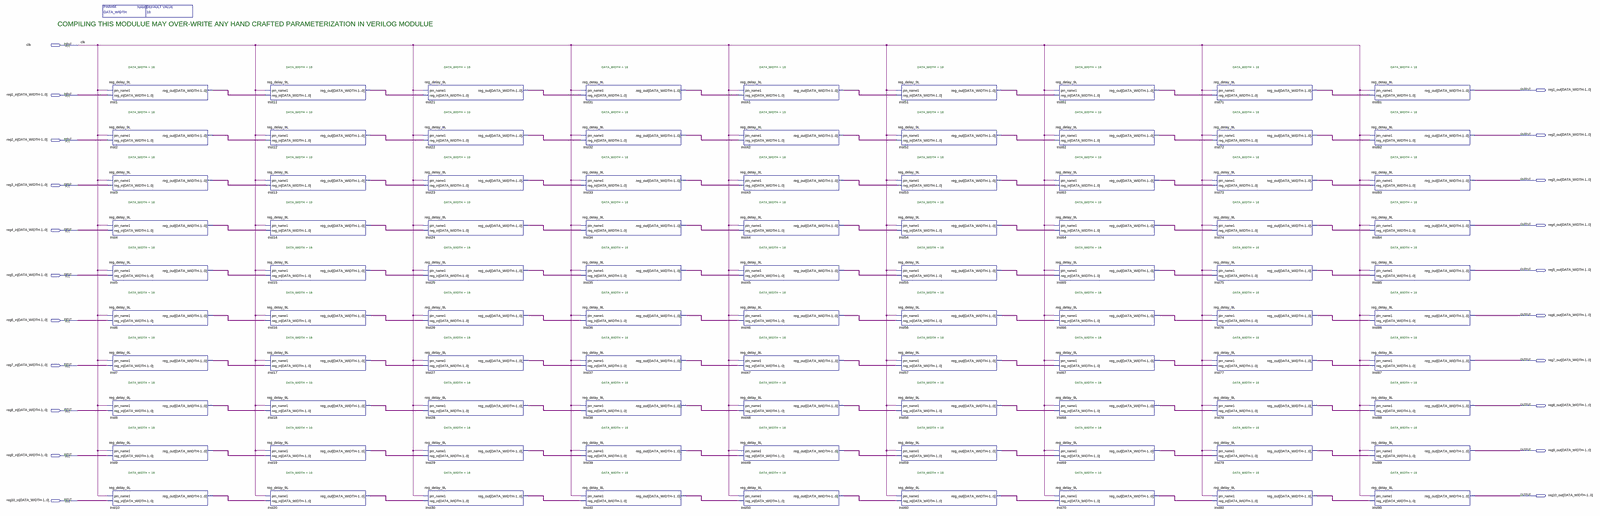
[diagram p0: schematic sheet, whole]
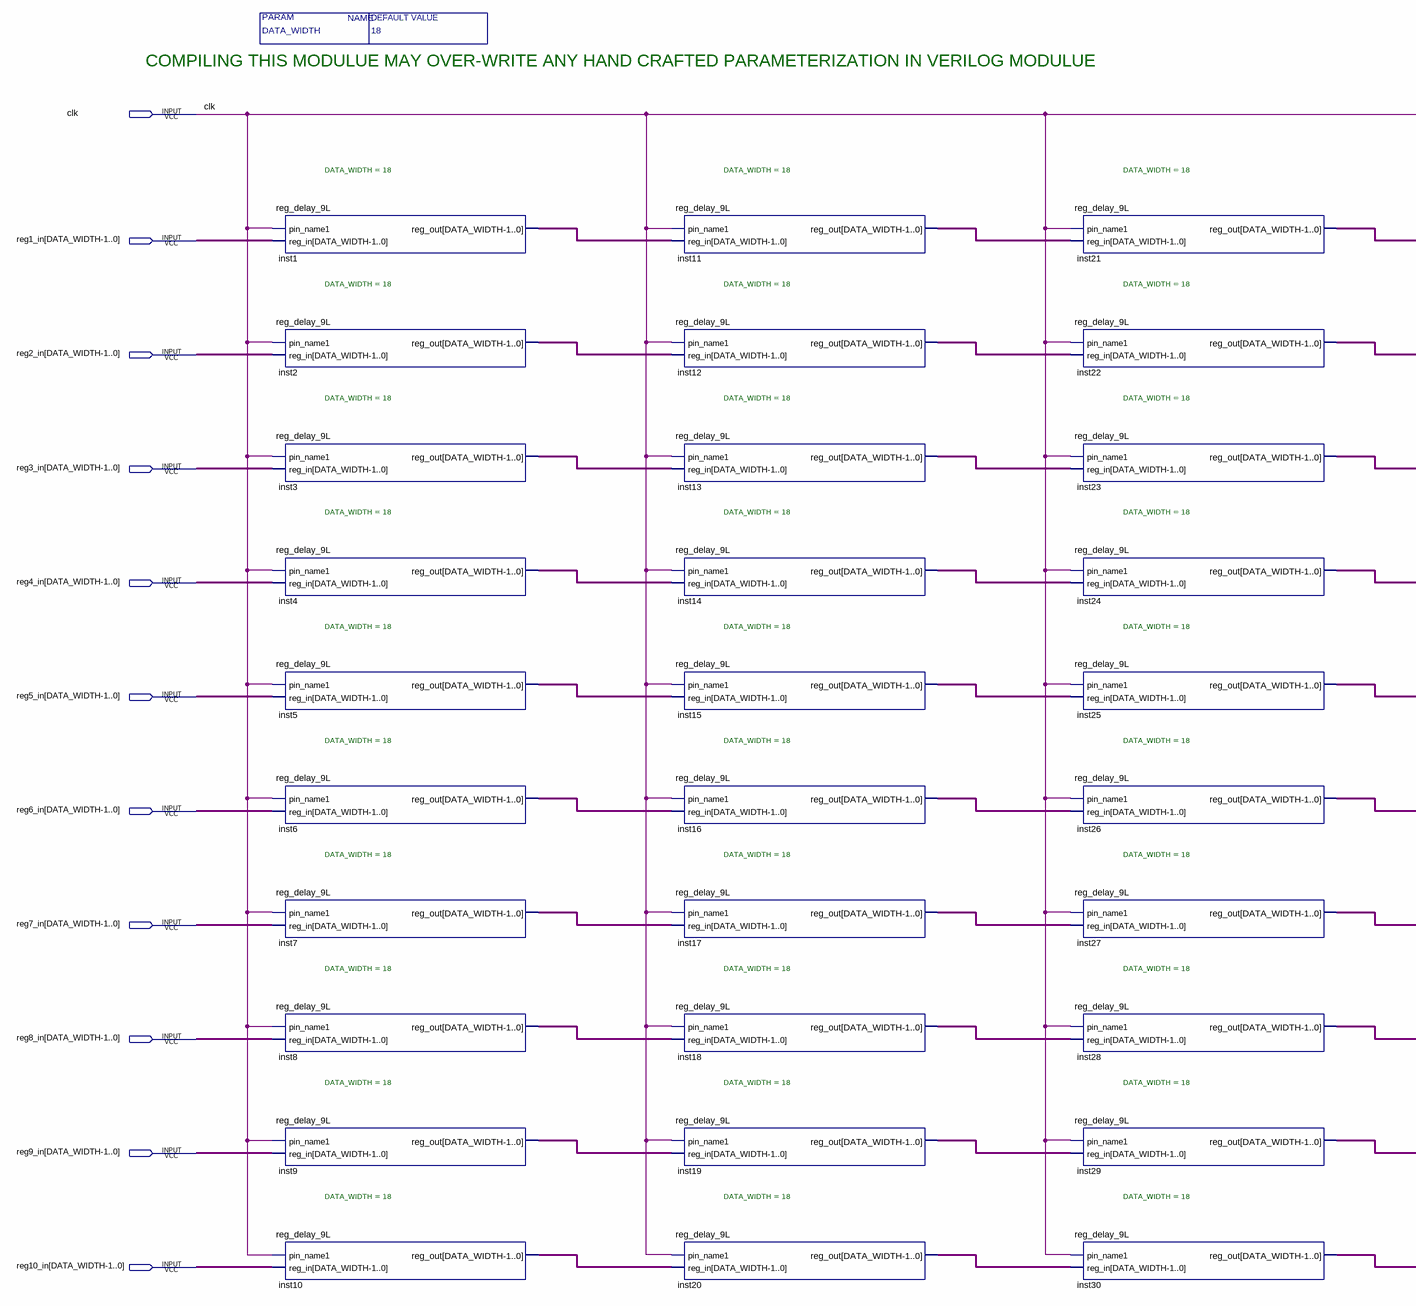
[diagram p1: schematic sheet, left part]
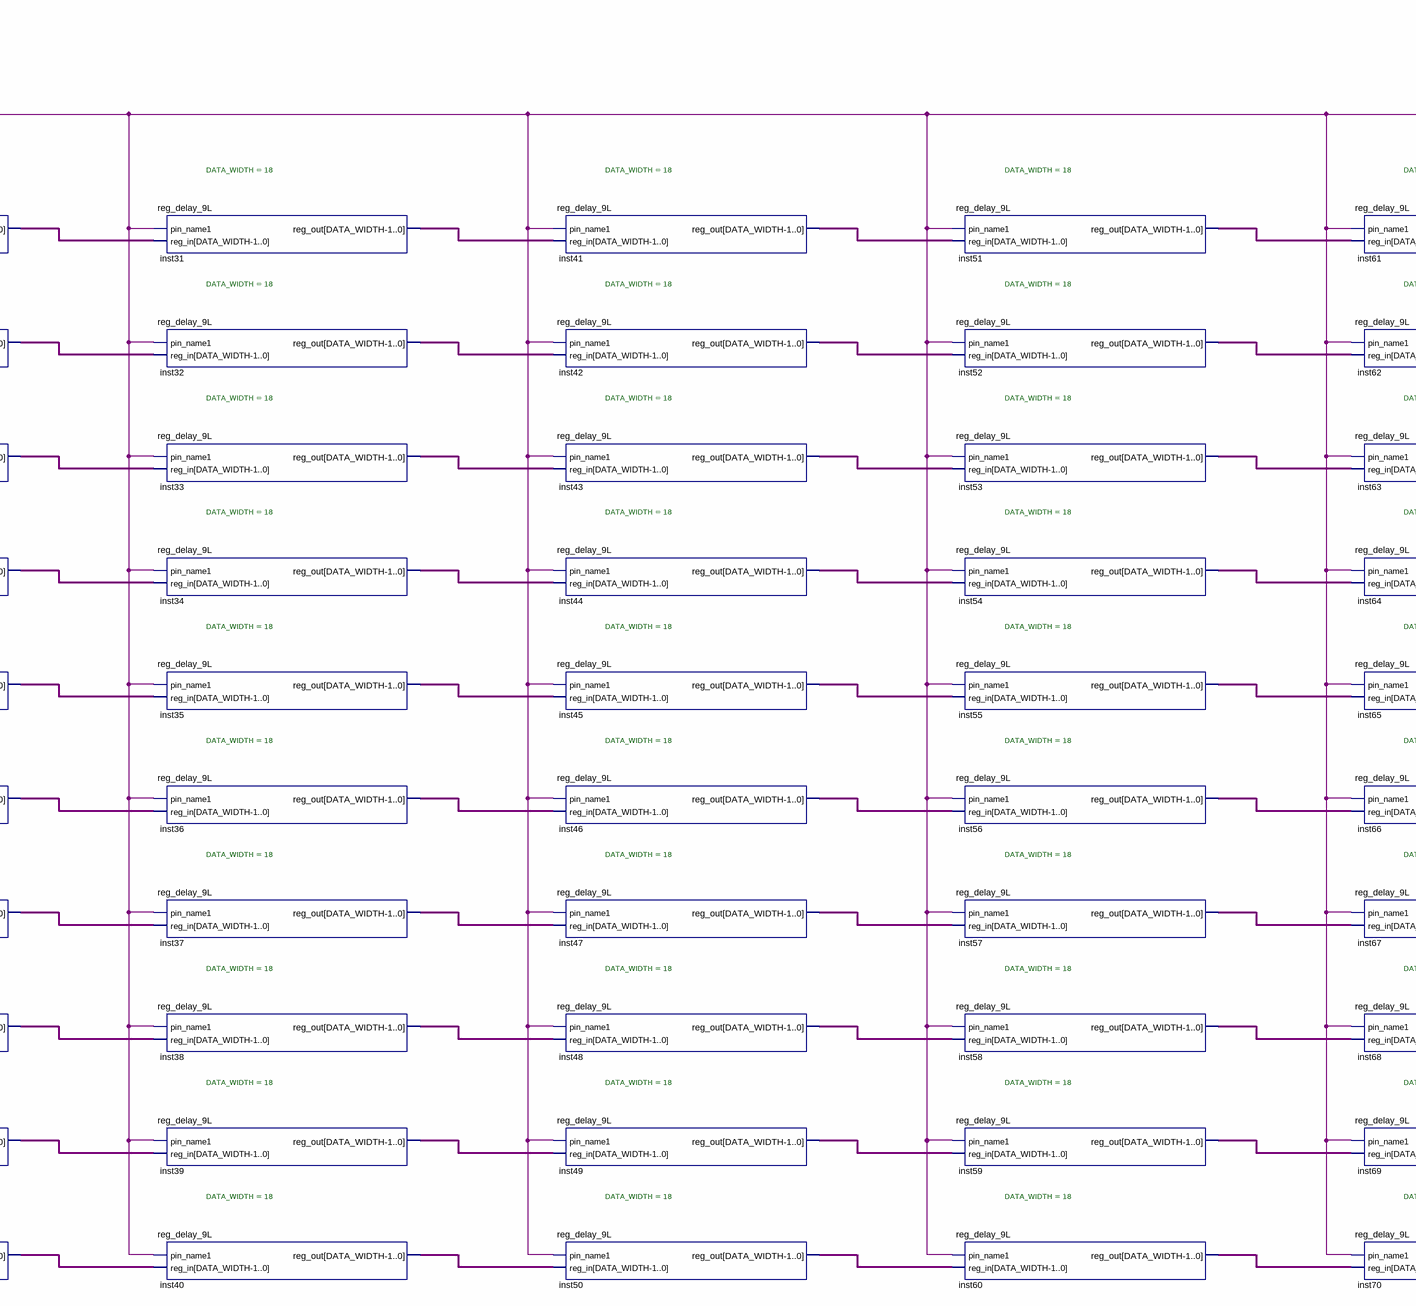
[diagram p2: schematic sheet, centre part]
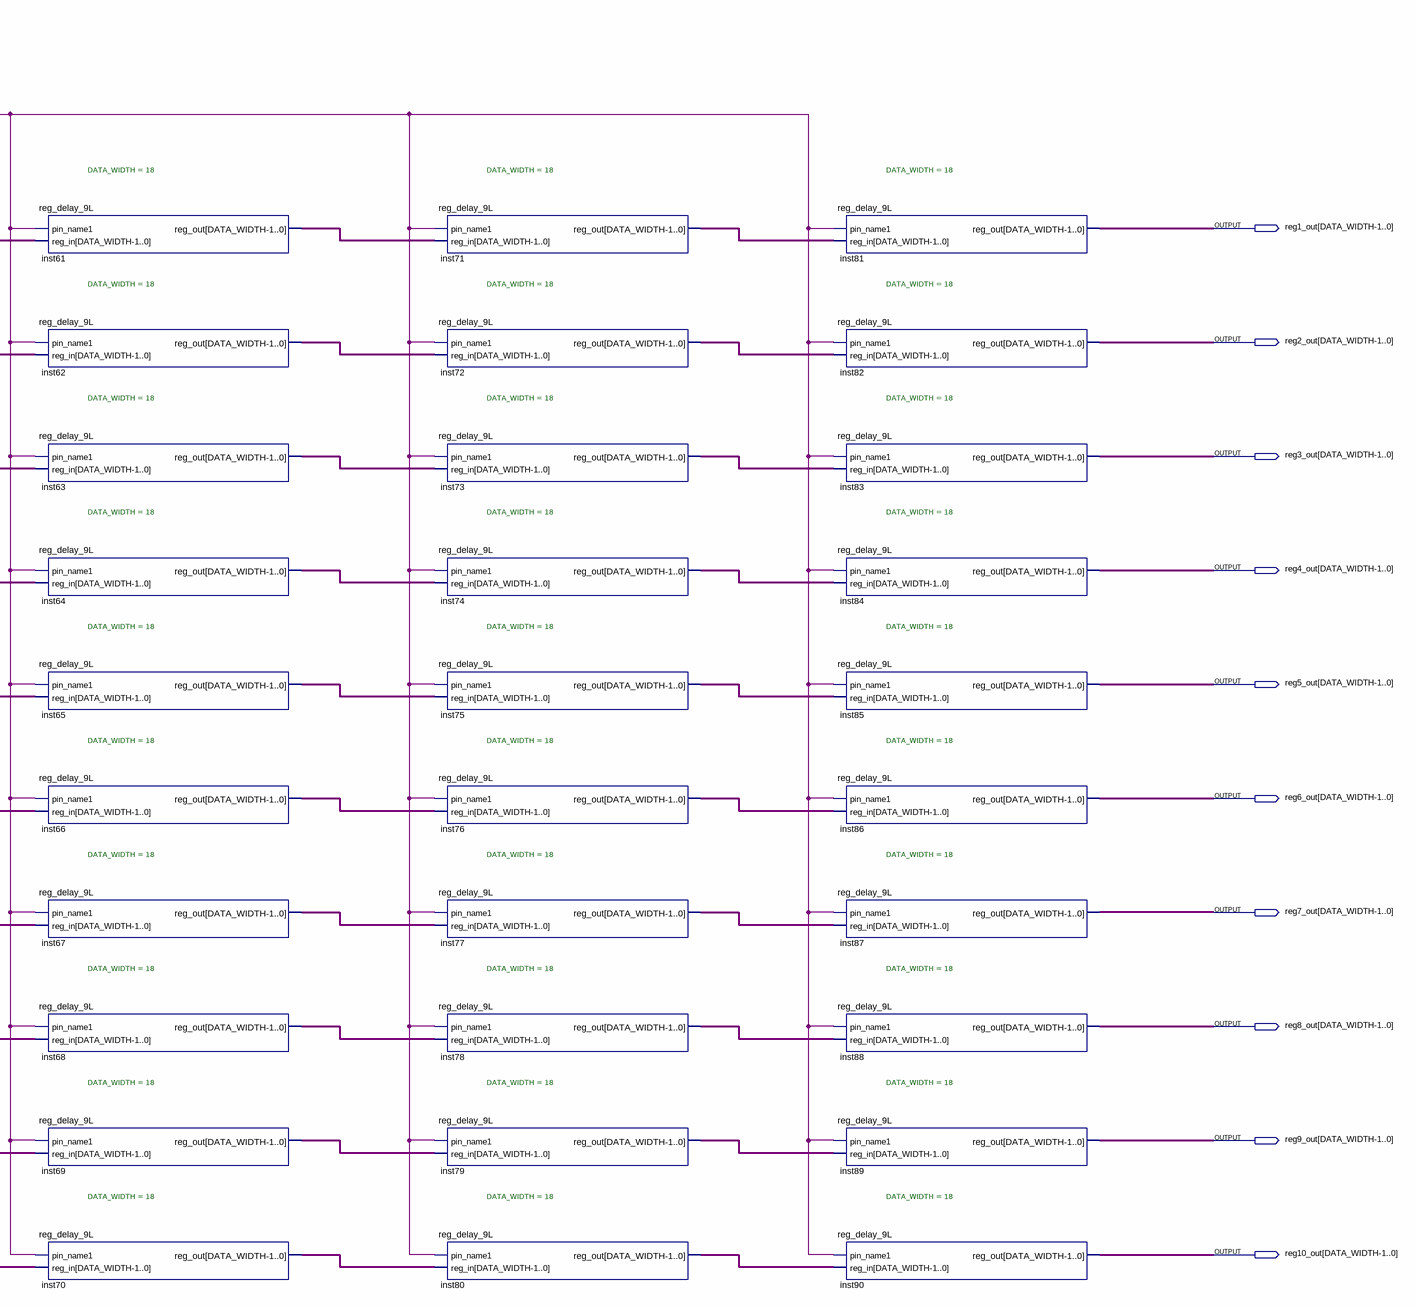
[diagram p3: schematic sheet, right part]
// Quartus schematic reg_delay_81L_x10.bdf as structural Verilog: 90 symbols, 21 pins
module reg_delay_81L_x10 #(parameter DATA_WIDTH = 18) (
  input  clk,
  input  [17:0] reg1_in,
  input  [17:0] reg2_in,
  input  [17:0] reg3_in,
  input  [17:0] reg4_in,
  input  [17:0] reg5_in,
  input  [17:0] reg6_in,
  input  [17:0] reg7_in,
  input  [17:0] reg8_in,
  input  [17:0] reg9_in,
  input  [17:0] reg10_in,
  output [17:0] reg1_out,
  output [17:0] reg2_out,
  output [17:0] reg3_out,
  output [17:0] reg4_out,
  output [17:0] reg5_out,
  output [17:0] reg6_out,
  output [17:0] reg7_out,
  output [17:0] reg8_out,
  output [17:0] reg9_out,
  output [17:0] reg10_out
);

  wire [17:0] inst1_reg_out, inst2_reg_out, inst3_reg_out, inst4_reg_out, inst5_reg_out, inst6_reg_out,
       inst7_reg_out, inst8_reg_out, inst9_reg_out, inst10_reg_out, inst11_reg_out, inst12_reg_out,
       inst13_reg_out, inst14_reg_out, inst15_reg_out, inst16_reg_out, inst17_reg_out, inst18_reg_out,
       inst19_reg_out, inst20_reg_out, inst21_reg_out, inst22_reg_out, inst23_reg_out, inst24_reg_out,
       inst25_reg_out, inst26_reg_out, inst27_reg_out, inst28_reg_out, inst29_reg_out, inst30_reg_out,
       inst31_reg_out, inst32_reg_out, inst33_reg_out, inst34_reg_out, inst35_reg_out, inst36_reg_out,
       inst37_reg_out, inst38_reg_out, inst39_reg_out, inst40_reg_out, inst41_reg_out, inst42_reg_out,
       inst43_reg_out, inst44_reg_out, inst45_reg_out, inst46_reg_out, inst47_reg_out, inst48_reg_out,
       inst49_reg_out, inst50_reg_out, inst51_reg_out, inst52_reg_out, inst53_reg_out, inst54_reg_out,
       inst55_reg_out, inst56_reg_out, inst57_reg_out, inst58_reg_out, inst59_reg_out, inst60_reg_out,
       inst61_reg_out, inst62_reg_out, inst63_reg_out, inst64_reg_out, inst65_reg_out, inst66_reg_out,
       inst67_reg_out, inst68_reg_out, inst69_reg_out, inst70_reg_out, inst71_reg_out, inst72_reg_out,
       inst73_reg_out, inst74_reg_out, inst75_reg_out, inst76_reg_out, inst77_reg_out, inst78_reg_out,
       inst79_reg_out, inst80_reg_out;

  reg_delay_9L #(.DATA_WIDTH(18)) inst1 (.pin_name1(clk), .reg_in(reg1_in), .reg_out(inst1_reg_out));
  reg_delay_9L #(.DATA_WIDTH(18)) inst2 (.pin_name1(clk), .reg_in(reg2_in), .reg_out(inst2_reg_out));
  reg_delay_9L #(.DATA_WIDTH(18)) inst3 (.pin_name1(clk), .reg_in(reg3_in), .reg_out(inst3_reg_out));
  reg_delay_9L #(.DATA_WIDTH(18)) inst4 (.pin_name1(clk), .reg_in(reg4_in), .reg_out(inst4_reg_out));
  reg_delay_9L #(.DATA_WIDTH(18)) inst5 (.pin_name1(clk), .reg_in(reg5_in), .reg_out(inst5_reg_out));
  reg_delay_9L #(.DATA_WIDTH(18)) inst6 (.pin_name1(clk), .reg_in(reg6_in), .reg_out(inst6_reg_out));
  reg_delay_9L #(.DATA_WIDTH(18)) inst7 (.pin_name1(clk), .reg_in(reg7_in), .reg_out(inst7_reg_out));
  reg_delay_9L #(.DATA_WIDTH(18)) inst8 (.pin_name1(clk), .reg_in(reg8_in), .reg_out(inst8_reg_out));
  reg_delay_9L #(.DATA_WIDTH(18)) inst9 (.pin_name1(clk), .reg_in(reg9_in), .reg_out(inst9_reg_out));
  reg_delay_9L #(.DATA_WIDTH(18)) inst10 (.pin_name1(clk), .reg_in(reg10_in), .reg_out(inst10_reg_out));
  reg_delay_9L #(.DATA_WIDTH(18)) inst11 (.pin_name1(clk), .reg_in(inst1_reg_out), .reg_out(inst11_reg_out));
  reg_delay_9L #(.DATA_WIDTH(18)) inst12 (.pin_name1(clk), .reg_in(inst2_reg_out), .reg_out(inst12_reg_out));
  reg_delay_9L #(.DATA_WIDTH(18)) inst13 (.pin_name1(clk), .reg_in(inst3_reg_out), .reg_out(inst13_reg_out));
  reg_delay_9L #(.DATA_WIDTH(18)) inst14 (.pin_name1(clk), .reg_in(inst4_reg_out), .reg_out(inst14_reg_out));
  reg_delay_9L #(.DATA_WIDTH(18)) inst15 (.pin_name1(clk), .reg_in(inst5_reg_out), .reg_out(inst15_reg_out));
  reg_delay_9L #(.DATA_WIDTH(18)) inst16 (.pin_name1(clk), .reg_in(inst6_reg_out), .reg_out(inst16_reg_out));
  reg_delay_9L #(.DATA_WIDTH(18)) inst17 (.pin_name1(clk), .reg_in(inst7_reg_out), .reg_out(inst17_reg_out));
  reg_delay_9L #(.DATA_WIDTH(18)) inst18 (.pin_name1(clk), .reg_in(inst8_reg_out), .reg_out(inst18_reg_out));
  reg_delay_9L #(.DATA_WIDTH(18)) inst19 (.pin_name1(clk), .reg_in(inst9_reg_out), .reg_out(inst19_reg_out));
  reg_delay_9L #(.DATA_WIDTH(18)) inst20 (.pin_name1(clk), .reg_in(inst10_reg_out), .reg_out(inst20_reg_out));
  reg_delay_9L #(.DATA_WIDTH(18)) inst21 (.pin_name1(clk), .reg_in(inst11_reg_out), .reg_out(inst21_reg_out));
  reg_delay_9L #(.DATA_WIDTH(18)) inst22 (.pin_name1(clk), .reg_in(inst12_reg_out), .reg_out(inst22_reg_out));
  reg_delay_9L #(.DATA_WIDTH(18)) inst23 (.pin_name1(clk), .reg_in(inst13_reg_out), .reg_out(inst23_reg_out));
  reg_delay_9L #(.DATA_WIDTH(18)) inst24 (.pin_name1(clk), .reg_in(inst14_reg_out), .reg_out(inst24_reg_out));
  reg_delay_9L #(.DATA_WIDTH(18)) inst25 (.pin_name1(clk), .reg_in(inst15_reg_out), .reg_out(inst25_reg_out));
  reg_delay_9L #(.DATA_WIDTH(18)) inst26 (.pin_name1(clk), .reg_in(inst16_reg_out), .reg_out(inst26_reg_out));
  reg_delay_9L #(.DATA_WIDTH(18)) inst27 (.pin_name1(clk), .reg_in(inst17_reg_out), .reg_out(inst27_reg_out));
  reg_delay_9L #(.DATA_WIDTH(18)) inst28 (.pin_name1(clk), .reg_in(inst18_reg_out), .reg_out(inst28_reg_out));
  reg_delay_9L #(.DATA_WIDTH(18)) inst29 (.pin_name1(clk), .reg_in(inst19_reg_out), .reg_out(inst29_reg_out));
  reg_delay_9L #(.DATA_WIDTH(18)) inst30 (.pin_name1(clk), .reg_in(inst20_reg_out), .reg_out(inst30_reg_out));
  reg_delay_9L #(.DATA_WIDTH(18)) inst31 (.pin_name1(clk), .reg_in(inst21_reg_out), .reg_out(inst31_reg_out));
  reg_delay_9L #(.DATA_WIDTH(18)) inst32 (.pin_name1(clk), .reg_in(inst22_reg_out), .reg_out(inst32_reg_out));
  reg_delay_9L #(.DATA_WIDTH(18)) inst33 (.pin_name1(clk), .reg_in(inst23_reg_out), .reg_out(inst33_reg_out));
  reg_delay_9L #(.DATA_WIDTH(18)) inst34 (.pin_name1(clk), .reg_in(inst24_reg_out), .reg_out(inst34_reg_out));
  reg_delay_9L #(.DATA_WIDTH(18)) inst35 (.pin_name1(clk), .reg_in(inst25_reg_out), .reg_out(inst35_reg_out));
  reg_delay_9L #(.DATA_WIDTH(18)) inst36 (.pin_name1(clk), .reg_in(inst26_reg_out), .reg_out(inst36_reg_out));
  reg_delay_9L #(.DATA_WIDTH(18)) inst37 (.pin_name1(clk), .reg_in(inst27_reg_out), .reg_out(inst37_reg_out));
  reg_delay_9L #(.DATA_WIDTH(18)) inst38 (.pin_name1(clk), .reg_in(inst28_reg_out), .reg_out(inst38_reg_out));
  reg_delay_9L #(.DATA_WIDTH(18)) inst39 (.pin_name1(clk), .reg_in(inst29_reg_out), .reg_out(inst39_reg_out));
  reg_delay_9L #(.DATA_WIDTH(18)) inst40 (.pin_name1(clk), .reg_in(inst30_reg_out), .reg_out(inst40_reg_out));
  reg_delay_9L #(.DATA_WIDTH(18)) inst41 (.pin_name1(clk), .reg_in(inst31_reg_out), .reg_out(inst41_reg_out));
  reg_delay_9L #(.DATA_WIDTH(18)) inst42 (.pin_name1(clk), .reg_in(inst32_reg_out), .reg_out(inst42_reg_out));
  reg_delay_9L #(.DATA_WIDTH(18)) inst43 (.pin_name1(clk), .reg_in(inst33_reg_out), .reg_out(inst43_reg_out));
  reg_delay_9L #(.DATA_WIDTH(18)) inst44 (.pin_name1(clk), .reg_in(inst34_reg_out), .reg_out(inst44_reg_out));
  reg_delay_9L #(.DATA_WIDTH(18)) inst45 (.pin_name1(clk), .reg_in(inst35_reg_out), .reg_out(inst45_reg_out));
  reg_delay_9L #(.DATA_WIDTH(18)) inst46 (.pin_name1(clk), .reg_in(inst36_reg_out), .reg_out(inst46_reg_out));
  reg_delay_9L #(.DATA_WIDTH(18)) inst47 (.pin_name1(clk), .reg_in(inst37_reg_out), .reg_out(inst47_reg_out));
  reg_delay_9L #(.DATA_WIDTH(18)) inst48 (.pin_name1(clk), .reg_in(inst38_reg_out), .reg_out(inst48_reg_out));
  reg_delay_9L #(.DATA_WIDTH(18)) inst49 (.pin_name1(clk), .reg_in(inst39_reg_out), .reg_out(inst49_reg_out));
  reg_delay_9L #(.DATA_WIDTH(18)) inst50 (.pin_name1(clk), .reg_in(inst40_reg_out), .reg_out(inst50_reg_out));
  reg_delay_9L #(.DATA_WIDTH(18)) inst51 (.pin_name1(clk), .reg_in(inst41_reg_out), .reg_out(inst51_reg_out));
  reg_delay_9L #(.DATA_WIDTH(18)) inst52 (.pin_name1(clk), .reg_in(inst42_reg_out), .reg_out(inst52_reg_out));
  reg_delay_9L #(.DATA_WIDTH(18)) inst53 (.pin_name1(clk), .reg_in(inst43_reg_out), .reg_out(inst53_reg_out));
  reg_delay_9L #(.DATA_WIDTH(18)) inst54 (.pin_name1(clk), .reg_in(inst44_reg_out), .reg_out(inst54_reg_out));
  reg_delay_9L #(.DATA_WIDTH(18)) inst55 (.pin_name1(clk), .reg_in(inst45_reg_out), .reg_out(inst55_reg_out));
  reg_delay_9L #(.DATA_WIDTH(18)) inst56 (.pin_name1(clk), .reg_in(inst46_reg_out), .reg_out(inst56_reg_out));
  reg_delay_9L #(.DATA_WIDTH(18)) inst57 (.pin_name1(clk), .reg_in(inst47_reg_out), .reg_out(inst57_reg_out));
  reg_delay_9L #(.DATA_WIDTH(18)) inst58 (.pin_name1(clk), .reg_in(inst48_reg_out), .reg_out(inst58_reg_out));
  reg_delay_9L #(.DATA_WIDTH(18)) inst59 (.pin_name1(clk), .reg_in(inst49_reg_out), .reg_out(inst59_reg_out));
  reg_delay_9L #(.DATA_WIDTH(18)) inst60 (.pin_name1(clk), .reg_in(inst50_reg_out), .reg_out(inst60_reg_out));
  reg_delay_9L #(.DATA_WIDTH(18)) inst61 (.pin_name1(clk), .reg_in(inst51_reg_out), .reg_out(inst61_reg_out));
  reg_delay_9L #(.DATA_WIDTH(18)) inst62 (.pin_name1(clk), .reg_in(inst52_reg_out), .reg_out(inst62_reg_out));
  reg_delay_9L #(.DATA_WIDTH(18)) inst63 (.pin_name1(clk), .reg_in(inst53_reg_out), .reg_out(inst63_reg_out));
  reg_delay_9L #(.DATA_WIDTH(18)) inst64 (.pin_name1(clk), .reg_in(inst54_reg_out), .reg_out(inst64_reg_out));
  reg_delay_9L #(.DATA_WIDTH(18)) inst65 (.pin_name1(clk), .reg_in(inst55_reg_out), .reg_out(inst65_reg_out));
  reg_delay_9L #(.DATA_WIDTH(18)) inst66 (.pin_name1(clk), .reg_in(inst56_reg_out), .reg_out(inst66_reg_out));
  reg_delay_9L #(.DATA_WIDTH(18)) inst67 (.pin_name1(clk), .reg_in(inst57_reg_out), .reg_out(inst67_reg_out));
  reg_delay_9L #(.DATA_WIDTH(18)) inst68 (.pin_name1(clk), .reg_in(inst58_reg_out), .reg_out(inst68_reg_out));
  reg_delay_9L #(.DATA_WIDTH(18)) inst69 (.pin_name1(clk), .reg_in(inst59_reg_out), .reg_out(inst69_reg_out));
  reg_delay_9L #(.DATA_WIDTH(18)) inst70 (.pin_name1(clk), .reg_in(inst60_reg_out), .reg_out(inst70_reg_out));
  reg_delay_9L #(.DATA_WIDTH(18)) inst71 (.pin_name1(clk), .reg_in(inst61_reg_out), .reg_out(inst71_reg_out));
  reg_delay_9L #(.DATA_WIDTH(18)) inst72 (.pin_name1(clk), .reg_in(inst62_reg_out), .reg_out(inst72_reg_out));
  reg_delay_9L #(.DATA_WIDTH(18)) inst73 (.pin_name1(clk), .reg_in(inst63_reg_out), .reg_out(inst73_reg_out));
  reg_delay_9L #(.DATA_WIDTH(18)) inst74 (.pin_name1(clk), .reg_in(inst64_reg_out), .reg_out(inst74_reg_out));
  reg_delay_9L #(.DATA_WIDTH(18)) inst75 (.pin_name1(clk), .reg_in(inst65_reg_out), .reg_out(inst75_reg_out));
  reg_delay_9L #(.DATA_WIDTH(18)) inst76 (.pin_name1(clk), .reg_in(inst66_reg_out), .reg_out(inst76_reg_out));
  reg_delay_9L #(.DATA_WIDTH(18)) inst77 (.pin_name1(clk), .reg_in(inst67_reg_out), .reg_out(inst77_reg_out));
  reg_delay_9L #(.DATA_WIDTH(18)) inst78 (.pin_name1(clk), .reg_in(inst68_reg_out), .reg_out(inst78_reg_out));
  reg_delay_9L #(.DATA_WIDTH(18)) inst79 (.pin_name1(clk), .reg_in(inst69_reg_out), .reg_out(inst79_reg_out));
  reg_delay_9L #(.DATA_WIDTH(18)) inst80 (.pin_name1(clk), .reg_in(inst70_reg_out), .reg_out(inst80_reg_out));
  reg_delay_9L #(.DATA_WIDTH(18)) inst81 (.pin_name1(clk), .reg_in(inst71_reg_out), .reg_out(reg1_out));
  reg_delay_9L #(.DATA_WIDTH(18)) inst82 (.pin_name1(clk), .reg_in(inst72_reg_out), .reg_out(reg2_out));
  reg_delay_9L #(.DATA_WIDTH(18)) inst83 (.pin_name1(clk), .reg_in(inst73_reg_out), .reg_out(reg3_out));
  reg_delay_9L #(.DATA_WIDTH(18)) inst84 (.pin_name1(clk), .reg_in(inst74_reg_out), .reg_out(reg4_out));
  reg_delay_9L #(.DATA_WIDTH(18)) inst85 (.pin_name1(clk), .reg_in(inst75_reg_out), .reg_out(reg5_out));
  reg_delay_9L #(.DATA_WIDTH(18)) inst86 (.pin_name1(clk), .reg_in(inst76_reg_out), .reg_out(reg6_out));
  reg_delay_9L #(.DATA_WIDTH(18)) inst87 (.pin_name1(clk), .reg_in(inst77_reg_out), .reg_out(reg7_out));
  reg_delay_9L #(.DATA_WIDTH(18)) inst88 (.pin_name1(clk), .reg_in(inst78_reg_out), .reg_out(reg8_out));
  reg_delay_9L #(.DATA_WIDTH(18)) inst89 (.pin_name1(clk), .reg_in(inst79_reg_out), .reg_out(reg9_out));
  reg_delay_9L #(.DATA_WIDTH(18)) inst90 (.pin_name1(clk), .reg_in(inst80_reg_out), .reg_out(reg10_out));

  // Notes on the sheet:
  //   COMPILING THIS MODULUE MAY OVER-WRITE ANY HAND CRAFTED PARAMETERIZATION IN VERILOG MODULUE
endmodule
